# Altium project Stepper_Motor_Control.PrjPcb
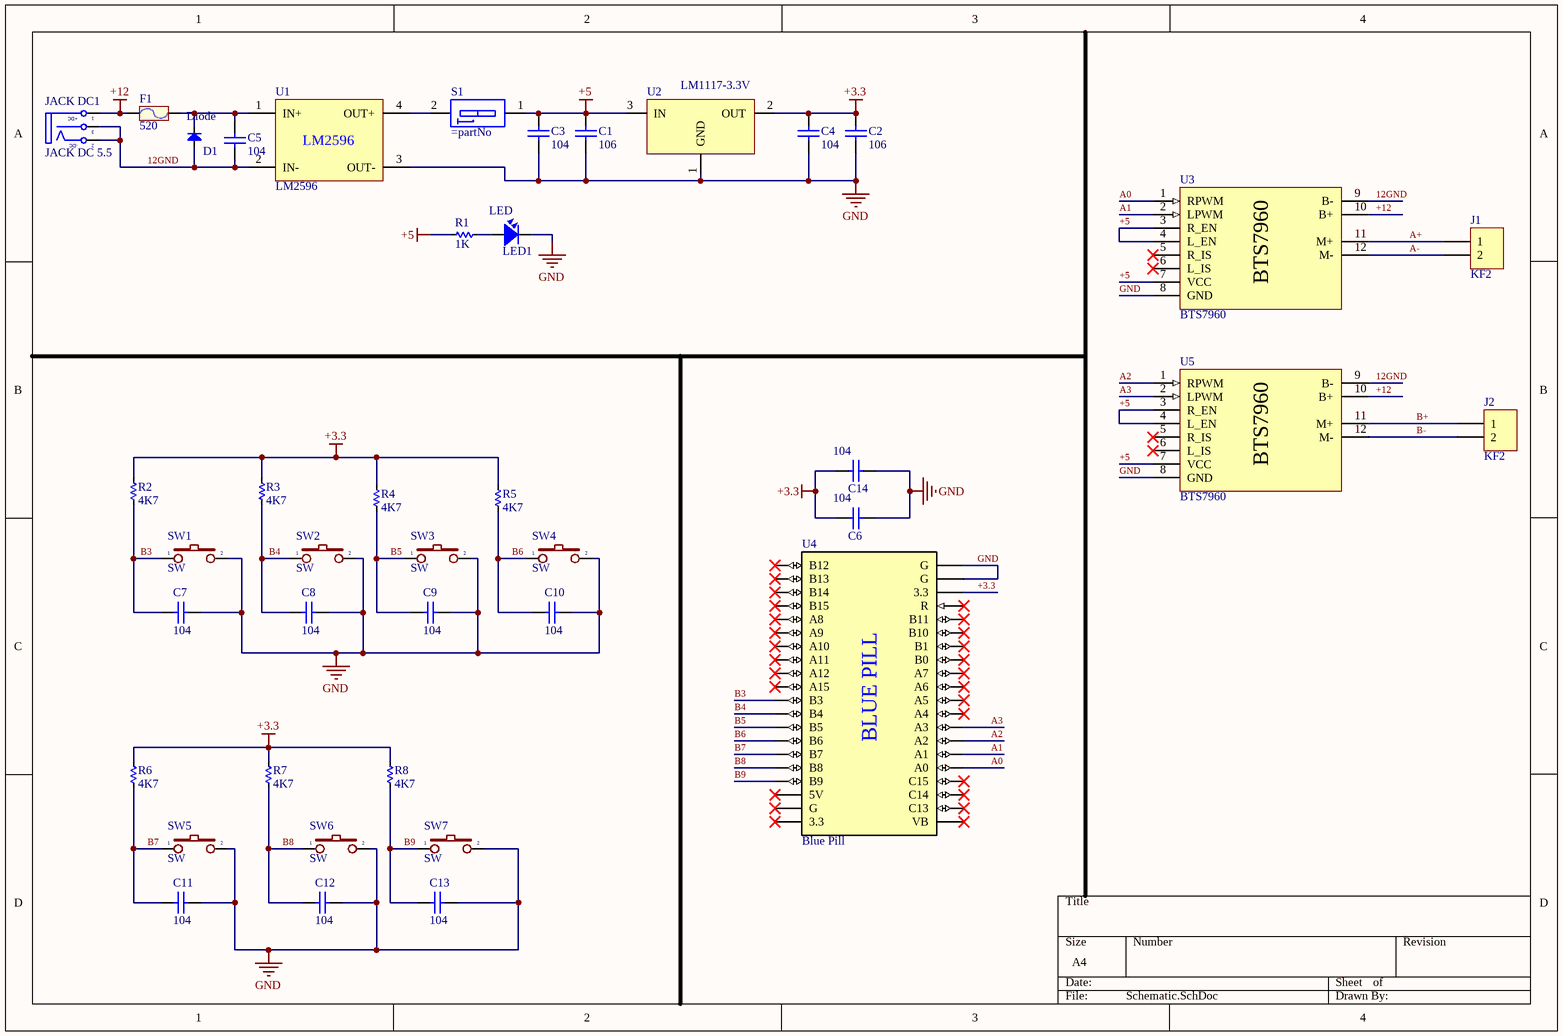
[diagram p0: Schematic.SchDoc]
1 sheet, 41 parts. Net scope: global (net labels, ports and power ports of the same name join across sheets).
Board file: PCB1.PcbDoc

## Sheet Schematic.SchDoc
size A4; SheetNumber: 1; SheetTotal: 1

### Parts
C1  106  [tu gom]
C2  106  [tu gom]
C3  104  [tu gom]
C4  104  [tu gom]
C5  104  [tu gom]
C6  104  [tu gom]
C7  104  [tu gom]
C8  104  [tu gom]
C9  104  [tu gom]
C10  104  [tu gom]
C11  104  [tu gom]
C12  104  [tu gom]
C13  104  [tu gom]
C14  104  [tu gom]
D1  Diode  [DIO-1A-SMALL]
F1  520  [De Cau Chi 520 630]
J1  KF2  [KF2-5.08]
J2  KF2  [KF2-5.08]
JACK_DC1  JACK DC 5.5  [JACK DC 5.5]
LED1  LED  [LED-3MM-YELLOW]
R1  1K  [RES-1/4W]
R2  4K7  [RES-1/4W]
R3  4K7  [RES-1/4W]
R4  4K7  [RES-1/4W]
R5  4K7  [RES-1/4W]
R6  4K7  [RES-1/4W]
R7  4K7  [RES-1/4W]
R8  4K7  [RES-1/4W]
S1  (no value)  [SW-DIP1]
SW1  SW  [SW2]
SW2  SW  [SW2]
SW3  SW  [SW2]
SW4  SW  [SW2]
SW5  SW  [SW2]
SW6  SW  [SW2]
SW7  SW  [SW2]
U1  LM2596  [LM2596 Module]
U2  LM1117-3.3V  [TO220-123]
U3  BTS7960  [BTS7960 Module]
U4  Blue Pill  [Blue Pill STM32F103]
U5  BTS7960  [BTS7960 Module]

### Nets
+3.3: C2.1 C4.1 C6.1 C14.1 R2.1 R3.1 R4.1 R5.1 R6.1 R7.1 R8.1 U2.2(OUT) U4.38(3.3)
+5: C1.1 C3.1 R1.2 S1.1 U2.3(IN) U3.3(R_EN) U3.4(L_EN) U3.7(VCC) U5.3(R_EN) U5.4(L_EN) U5.7(VCC)
+12: F1.1 JACK_DC1.1(T) U3.10(B+) U5.10(B+)
GND: C1.2 C2.2 C3.2 C4.2 C6.2 C7.2 C8.2 C9.2 C10.2 C11.2 C12.2 C13.2 C14.2 LED1.2 SW1.2 SW2.2 SW3.2 SW4.2 SW5.2 SW6.2 SW7.2 U1.3(OUT-) U2.1(GND) U3.8(GND) U4.39(G) U4.40(G) U5.8(GND)
12GND: C5.2 D1.1(A) JACK_DC1.2(TN) JACK_DC1.3(S) U1.2(IN-) U3.9(B-) U5.9(B-)
A0: U3.1(RPWM) U4.25(A0)
A1: U3.2(LPWM) U4.26(A1)
A2: U4.27(A2) U5.1(RPWM)
A3: U4.28(A3) U5.2(LPWM)
A+: J1.1 U3.11(M+)
A-: J1.2 U3.12(M-)
B3: C7.1 R2.2 SW1.1 U4.11(B3)
B4: C8.1 R3.2 SW2.1 U4.12(B4)
B5: C9.1 R4.2 SW3.1 U4.13(B5)
B6: C10.1 R5.2 SW4.1 U4.14(B6)
B7: C11.1 R6.2 SW5.1 U4.15(B7)
B8: C12.1 R7.2 SW6.1 U4.16(B8)
B9: C13.1 R8.2 SW7.1 U4.17(B9)
B+: J2.1 U5.11(M+)
B-: J2.2 U5.12(M-)
NetC5_1: C5.1 D1.2(K) F1.2 U1.1(IN+)
NetLED1_1: LED1.1 R1.1
NetS1_2: S1.2 U1.4(OUT+)

Not connected (* = marked no-connect by the designer): U3 5(R_IS)* 6(L_IS)*; U4 1(B12)* 2(B13)* 3(B14)* 4(B15)* 5(A8)* 6(A9)* 7(A10)* 8(A11)* 9(A12)* 10(A15)* 18(5V)* 19(G)* 20(3.3)* 21(VB)* 22(C13)* 23(C14)* 24(C15)* 29(A4)* 30(A5)* 31(A6)* 32(A7)* 33(B0)* 34(B1)* 35(B10)* 36(B11)* 37(R)*; U5 5(R_IS)* 6(L_IS)*

### Notes on the sheet
- (in symbol Blue Pill STM32F103) BLUE PILL
- (in symbol JACK DC 5.5) +DC; -DC

### Library data of the parts
C1-C14 = Tu gom 104 50V: Cắm; So_Chan: 2; Ten_Linh_Kien: Tụ gốm 104 100nF 50V; Don_Vi: Con; Ma_Hang: MH004761; Chung_Loai: Cắm; Kieu_Chan: *
D1 = Diode: Default Diode; Code - JEDEC: DO-214-AB; Value: 1N5007; Published: 8-Jun-2000; Revision: July-2002: Re-released for DXP Platform.; Publisher: Altium Limited
F1 = De Cau Chi 520 630: 5x20mm; Ma_Hang: MH001473; Ten: Đế Cầu Chì 5x20MM 6x30MM SMD01
J1 J2 = KF2: Manufacturer: Würth Elektronik eiSos GmbH; partNo: 691103110002; ComponentLink1 Description: Manufacturer; ComponentLink2 Description: Datasheet; NoPins: 2; Created Date: 29 October 2013; ComponentLink1URL: http://www.we-online.com; ComponentLink2URL: http://katalog.we-online.de/em/datasheet/6911031100xx.pdf; Created by: Karrer Zheng
JACK_DC1 = JACK DC 5.5: Value: Jac DC
LED1 = LED: LED Single colour Green and Red; Value: LED 3 ly Single Colour
R1-R8 = Res: Manufacturer: Generic Components; Class: Passive; SubClass: R; Published: 08/06/2000; Publisher: Altium Hobart Technology Centre
S1 = SWDIP1: WS-DITV 2.54 mm small compact THT flat actuator with top tape; Manufacturer: Wurth Elektronik; Part No.: 418127160901; ComponentLink1 Description: Manufacturer; ComponentLink2 Description: Datasheet; Pole: 01; Created Date: Dec.2015; ComponentLink1URL: http://www.we-online.com; ComponentLink2URL: http://katalog.we-online.de/em/datasheet/4181271609xx.pdf; Created by: Baojun Chen
SW1-SW7 = SW2: Switch button 2 pin; Value: SW chip 2 pin
U1 = LM2596 Module: DC - DC Buck
U2 = LM1117: 800mA Low-Dropout Linear Regulator; Creator: Nguyen Ba Bien; Website: http://group3i.net
U3 U5 = BTS7960 Module: Driver BTS Module
U4 = Blue Pill STM32F103: Blue Pill STM32F103C8T6